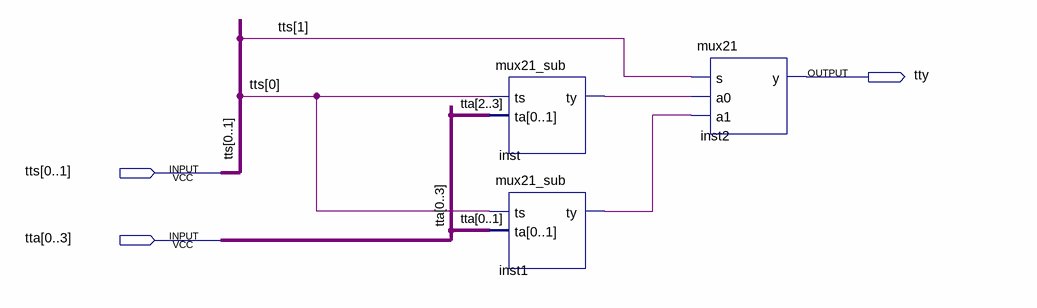
[diagram p0: schematic sheet]
// Quartus schematic main_test.bdf as structural Verilog: 3 symbols, 3 pins
module main_test (
  input  [0:1] tts,
  input  [0:3] tta,
  output tty
);

  wire inst1_ty, inst_ty;

  mux21_sub inst (.ts(tts[0]), .ta(tta[2:3]), .ty(inst_ty));
  mux21_sub inst1 (.ts(tts[0]), .ta(tta[0:1]), .ty(inst1_ty));
  mux21 inst2 (.s(tts[1]), .a0(inst_ty), .a1(inst1_ty), .y(tty));
endmodule
